# Altium project PCB_Project.PrjPcb
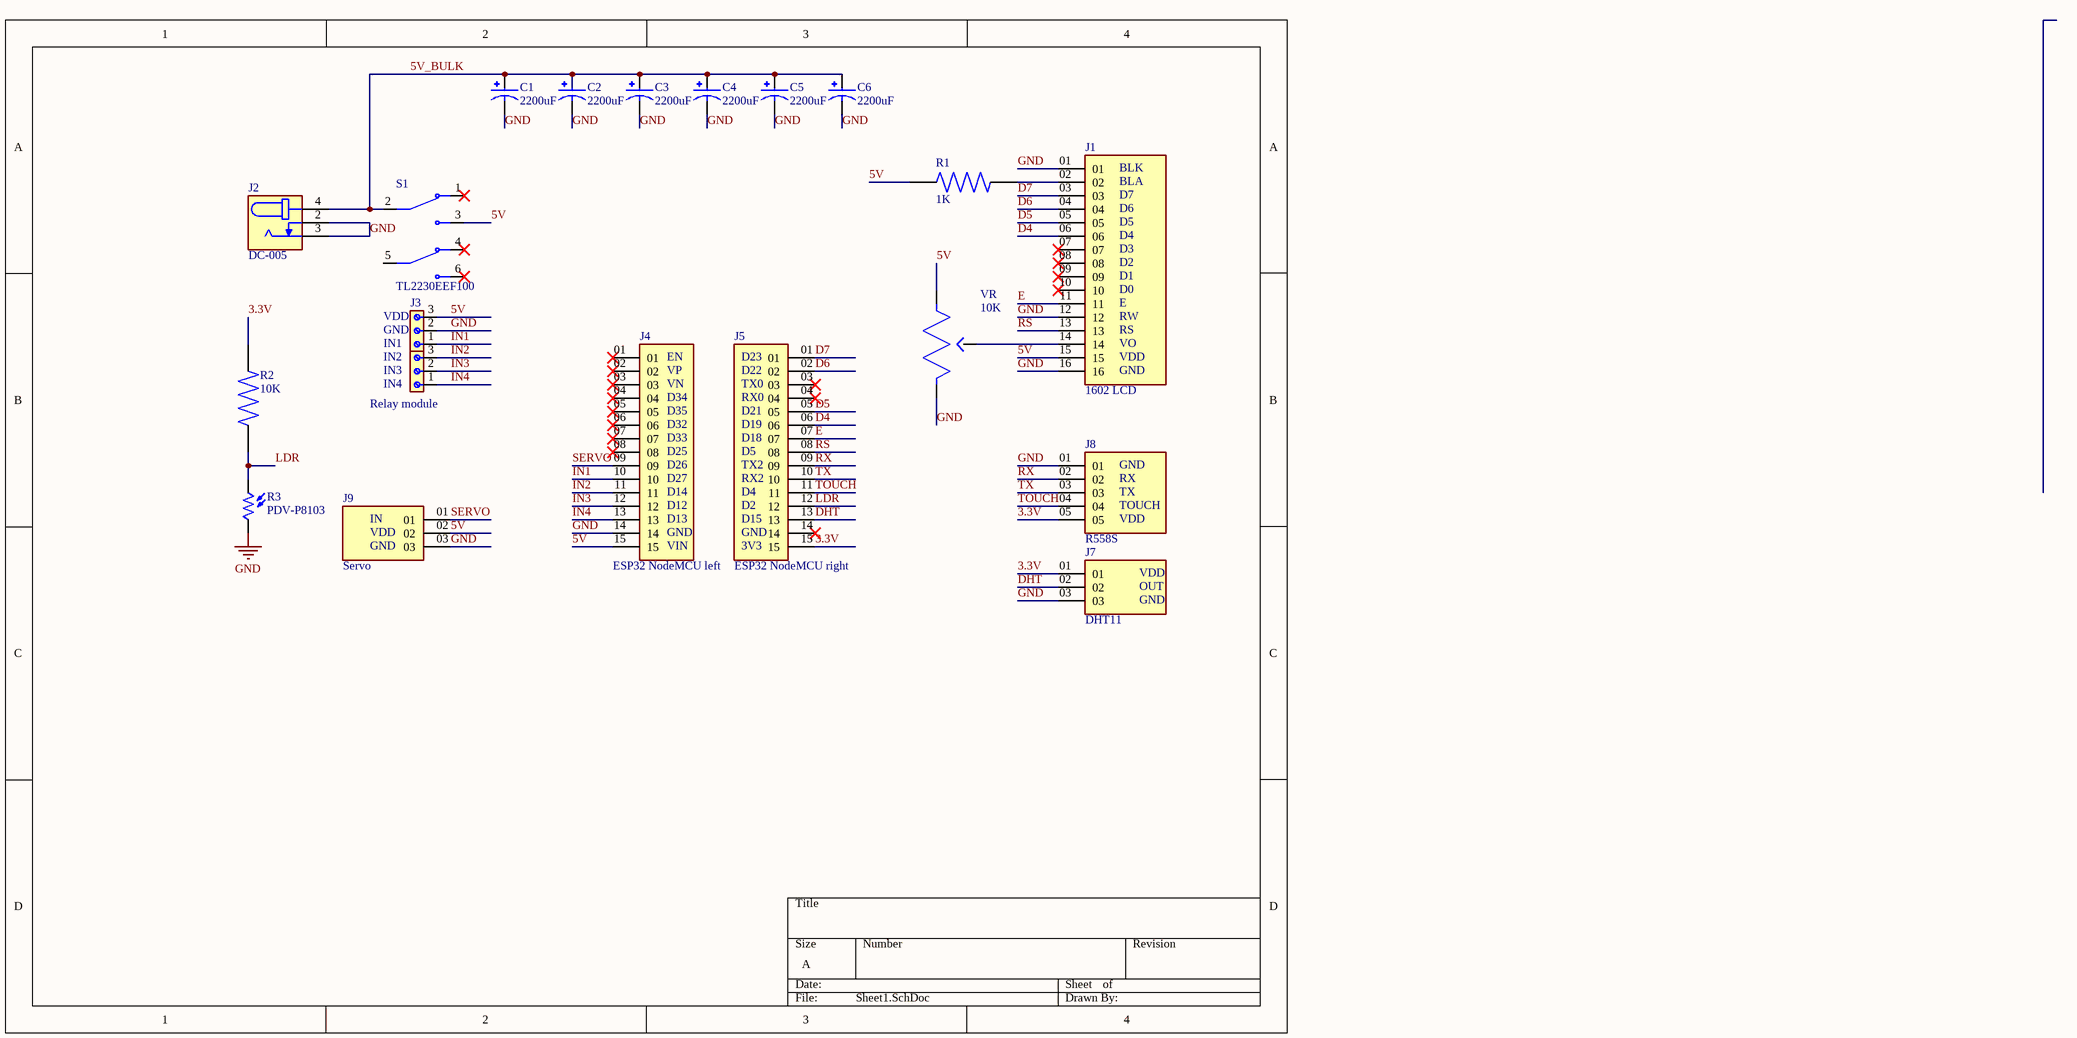
[diagram p0: Sheet1.SchDoc]
1 sheet, 20 parts. Net scope: global (net labels, ports and power ports of the same name join across sheets).
Board file: PCB1.PcbDoc

## Sheet Sheet1.SchDoc
size A; SheetNumber: 1; SheetTotal: 1

### Parts
C1  2200uF  [CAPPRD500W60D1250H2000]
C2  2200uF  [CAPPRD500W60D1250H2000]
C3  2200uF  [CAPPRD500W60D1250H2000]
C4  2200uF  [CAPPRD500W60D1250H2000]
C5  2200uF  [CAPPRD500W60D1250H2000]
C6  2200uF  [CAPPRD500W60D1250H2000]
J1  1602 LCD  [SAMTEC_TSW-116-08-F-S]
J2  DC-005  [NINIGI_DC-005]
J3  (no value)  [691213710003]
J4  ESP32 NodeMCU left  [SAMTEC_SSQ-115-X-X-S]
J5  ESP32 NodeMCU right  [SAMTEC_SSQ-115-X-X-S]
J6  Relay module  [691213710003]
J7  DHT11  [SAMTEC_TSW-103-08-F-S]
J8  R558S  [SAMTEC_MTLW-105-05-G-S-190]
J9  Servo  [SAMTEC_TSW-103-08-F-S]
R1  1K  [RESAD1100W55L680D260]
R2  10K  [RESAD1100W55L680D260]
R3  PDV-P8103  [PHODET_PDV-P8103]
S1  TL2230EEF100  [SW_TL2230EEF100]
VR  10K  [P160]

### Nets
GND: C1.N C2.N C3.N C4.N C5.N C6.N J1.01 J1.12 J1.16 J2.2 J2.3 J3.2 J4.14 J7.03 J8.01 J9.03 R3.2 VR.1
3.3V: J5.15 J7.01 J8.05 R2.1
5V: J1.15 J3.3 J4.15 J9.02 R1.1 S1.3(NO1) VR.3
5V_BULK: C1.P C2.P C3.P C4.P C5.P C6.P J2.4 S1.2(COM1)
D4: J1.06 J5.06
D5: J1.05 J5.05
D6: J1.04 J5.02
D7: J1.03 J5.01
DHT: J5.13 J7.02
E: J1.11 J5.07
IN1: J3.1 J4.10
IN2: J4.11 J6.3
IN3: J4.12 J6.2
IN4: J4.13 J6.1
LDR: J5.12 R2.2 R3.1
RS: J1.13 J5.08
RX: J5.09 J8.02
SERVO: J4.09 J9.01
TOUCH: J5.11 J8.04
TX: J5.10 J8.03
NetJ1_02: J1.02 R1.2
NetJ1_14: J1.14 VR.2

Not connected (* = marked no-connect by the designer): J1 07* 08* 09* 10*; J4 01* 02* 03* 04* 05* 06* 07* 08*; J5 03* 04* 14*; S1 1(NC1)* 4(NC2)* 5(COM2) 6(NO2)*

### Notes on the sheet
- (near J1) BLK
- (near J1) BLA
- (near J1) D7
- (near J1) D6
- (near J1) D5
- (near J1) D4
- (near J1) D3
- (near J1) D2
- (near J1) D1
- (near J1) D0
- (near J1) E
- VDD
- GND
- IN1
- IN2
- IN3
- (near J6) IN4
- (near J4) EN
- (near J4) VP
- (near J4) VN
- (near J5) D23
- (near J5) D22
- (near J5) TX0
- (near J1) RW
- (near J1) RS
- (near J1) VO
- (near J1) VDD
- (near J1) GND
- (near J4) D34
- (near J4) D35
- (near J4) D32
- (near J4) D33
- (near J5) RX0
- (near J5) D21
- (near J5) D19
- (near J5) D18
- (near J9) IN
- (near J4) D25
- (near J4) D26
- (near J4) D27
- (near J4) D14
- (near J4) D12
- (near J4) D13
- (near J5) D5
- (near J5) TX2
- (near J5) RX2
- (near J5) D4
- (near J5) D2
- (near J5) D15
- (near J8) GND
- (near J8) RX
- (near J8) TX
- (near J8) TOUCH
- (near J8) VDD
- (near J9) VDD
- (near J9) GND
- (near J4) GND
- (near J4) VIN
- (near J5) GND
- (near J5) 3V3
- (near J7) VDD
- (near J7) OUT
- (near J7) GND

### Library data of the parts
C1-C6 = EEUFR1C222: Cap Aluminum Lytic 2200uF 16V 20% (12.5 X 20mm) Radial 5mm 2600mA 10000h 105C Bulk; MF: Panasonic; Package: RADIAL-2 Panasonic; MP: EEUFR1C222; Check_prices: https://www.snapeda.com/parts/EEUFR1C222/Panasonic/view-part/1469066/?ref=eda; Value: *; Price: None; Availability: In Stock; SnapEDA_Link: https://www.snapeda.com/parts/EEUFR1C222/Panasonic/view-part/1469066/?ref=snap
J1 = TSW-116-08-F-S: Package: None; Price: None; Value: *; MP: TSW-116-08-F-S; Availability: Unavailable
J2 = DC-005: DC Jack; Availability: Unavailable; MP: DC-005; Value: *; Package: None; Price: None
J3 J6 = 691213710003: Serie 213 - 5,0mm pitch - Modular THT - Green - Horizontal cable entry Rising Cage Clamp 10mm height - 03p; MF: Wurth Electronics; SnapEDA_Link: https://www.snapeda.com/parts/691213710003/Wurth+Electronics/view-part/?ref=snap; Package: None; Value: *; MP: 691213710003; Check_prices: https://www.snapeda.com/parts/691213710003/Wurth+Electronics/view-part/?ref=eda
J4 J5 = SSQ-115-X-X-S: 15 Position Receptacle Connector 0.100 (2.54mm) Through Hole Gold; MP: SSQ-115-23-G-S; MF: Samtec; SnapEDA_Link: https://www.snapeda.com/parts/SSQ-115-23-G-S/Samtec/view-part/3249452/?ref=snap; Package: None; Availability: Not in stock; Price: None; Value: *; Check_prices: https://www.snapeda.com/parts/SSQ-115-23-G-S/Samtec/view-part/3249452/?ref=eda; Purchase-URL: https://pricing.snapeda.com/search/part/SSQ-115-23-G-S/?ref=eda
J7 J9 = TSW-103-08-F-S: Availability: Unavailable; MP: TSW-103-08-F-S; Price: None; Value: *; Package: None
J8 = MTLW-105-05-G-S-190: Value: *; Package: None; Price: None; MP: MTLW-105-05-G-S-190; Availability: Unavailable
R1 R2 = MFR-25FBF52-1K: 1.07 kOhms Â±1% 0.25W, 1/4W Through Hole Resistor Axial - Metal Film; MF: Yageo; SnapEDA_Link: https://www.snapeda.com/parts/MFR-25FBF52-1K/Yageo/view-part/?ref=snap; Package: RADIAL-2 YAGEO; Value: *; MP: MFR-25FBF52-1K; Check_prices: https://www.snapeda.com/parts/MFR-25FBF52-1K/Yageo/view-part/?ref=eda
R3 = PDV-P8103: CdS Cells 520nm 16 ~ 33kOhms @ 10 lux; MF: Advanced Photonix; SnapEDA_Link: https://www.snapeda.com/parts/PDV-P8103/Advanced+Photonix/view-part/?ref=snap; Package: Radial Advanced Photonix; Value: *; MP: PDV-P8103; Check_prices: https://www.snapeda.com/parts/PDV-P8103/Advanced+Photonix/view-part/?ref=eda
S1 = TL2230EEF100: Pushbutton Switch DPDT Standard Through Hole; MF: E-Switch; SnapEDA_Link: https://www.snapeda.com/parts/TL2230EEF100/E-Switch/view-part/?ref=snap; Package: None; Value: *; MP: TL2230EEF100; Check_prices: https://www.snapeda.com/parts/TL2230EEF100/E-Switch/view-part/?ref=eda
VR = P160KN-0QC15B500K: 500k Ohm 1 Gang Linear Panel Mount Potentiometer None 1 Turn Conductive Plastic 0.2W, 1/5W PC Pins; MF: TT Electronics/BI; Value: *; Digi-Key_Part_Number: 987-1304-ND; Package: None; Digi-Key_Purchase_URL: https://www.digikey.cz/product-detail/en/tt-electronics-bi/P160KN-0QC15B500K/987-1304-ND/2408881?utm_source=snapeda&utm_medium=aggregator&utm_campaign=symbol; MP: P160KN-0QC15B500K; SnapEDA_Link: https://www.snapeda.com/parts/P160KN-0QC15B500K/TT%20Electronics/BI/view-part/903272/?ref=snap